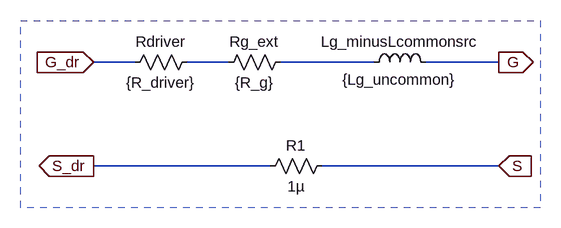
[diagram p0: schematic gate_cell_V1.asc]
gate_cell_V1.asc, the LTspice schematic file:
Version 4.1
SHEET 1 880 788
WIRE -176 96 -240 96
WIRE -32 96 -96 96
WIRE 192 96 48 96
WIRE 384 96 272 96
WIRE 32 256 -240 256
WIRE 384 256 112 256
FLAG -240 96 G_dr
IOPIN -240 96 In
FLAG -240 256 S_dr
IOPIN -240 256 Out
FLAG 384 96 G
IOPIN 384 96 Out
FLAG 384 256 S
IOPIN 384 256 In
SYMBOL res 64 80 R90
WINDOW 0 0 56 VBottom 2
WINDOW 3 32 56 VTop 2
SYMATTR InstName Rg_ext
SYMATTR Value {R_g}
SYMBOL ind 176 112 R270
WINDOW 0 32 56 VTop 2
WINDOW 3 5 56 VBottom 2
SYMATTR InstName Lg_minusLcommonsrc
SYMATTR Value {Lg_uncommon}
SYMBOL res -80 80 R90
WINDOW 0 0 56 VBottom 2
WINDOW 3 32 56 VTop 2
SYMATTR InstName Rdriver
SYMATTR Value {R_driver}
SYMBOL res 128 240 R90
WINDOW 0 0 56 VBottom 2
WINDOW 3 32 56 VTop 2
SYMATTR InstName R1
SYMATTR Value 1µ
RECTANGLE Normal 448 320 -352 32 3

The netlist it stands for:
* gate_cell_V1.asc
Rg_ext N002 N001 {R_g}
Lg_minusLcommonsrc N002 G {Lg_uncommon}
Rdriver N001 G_dr {R_driver}
R1 S S_dr 1µ
.backanno
.end